# Altium project PCB_Project.PrjPcb
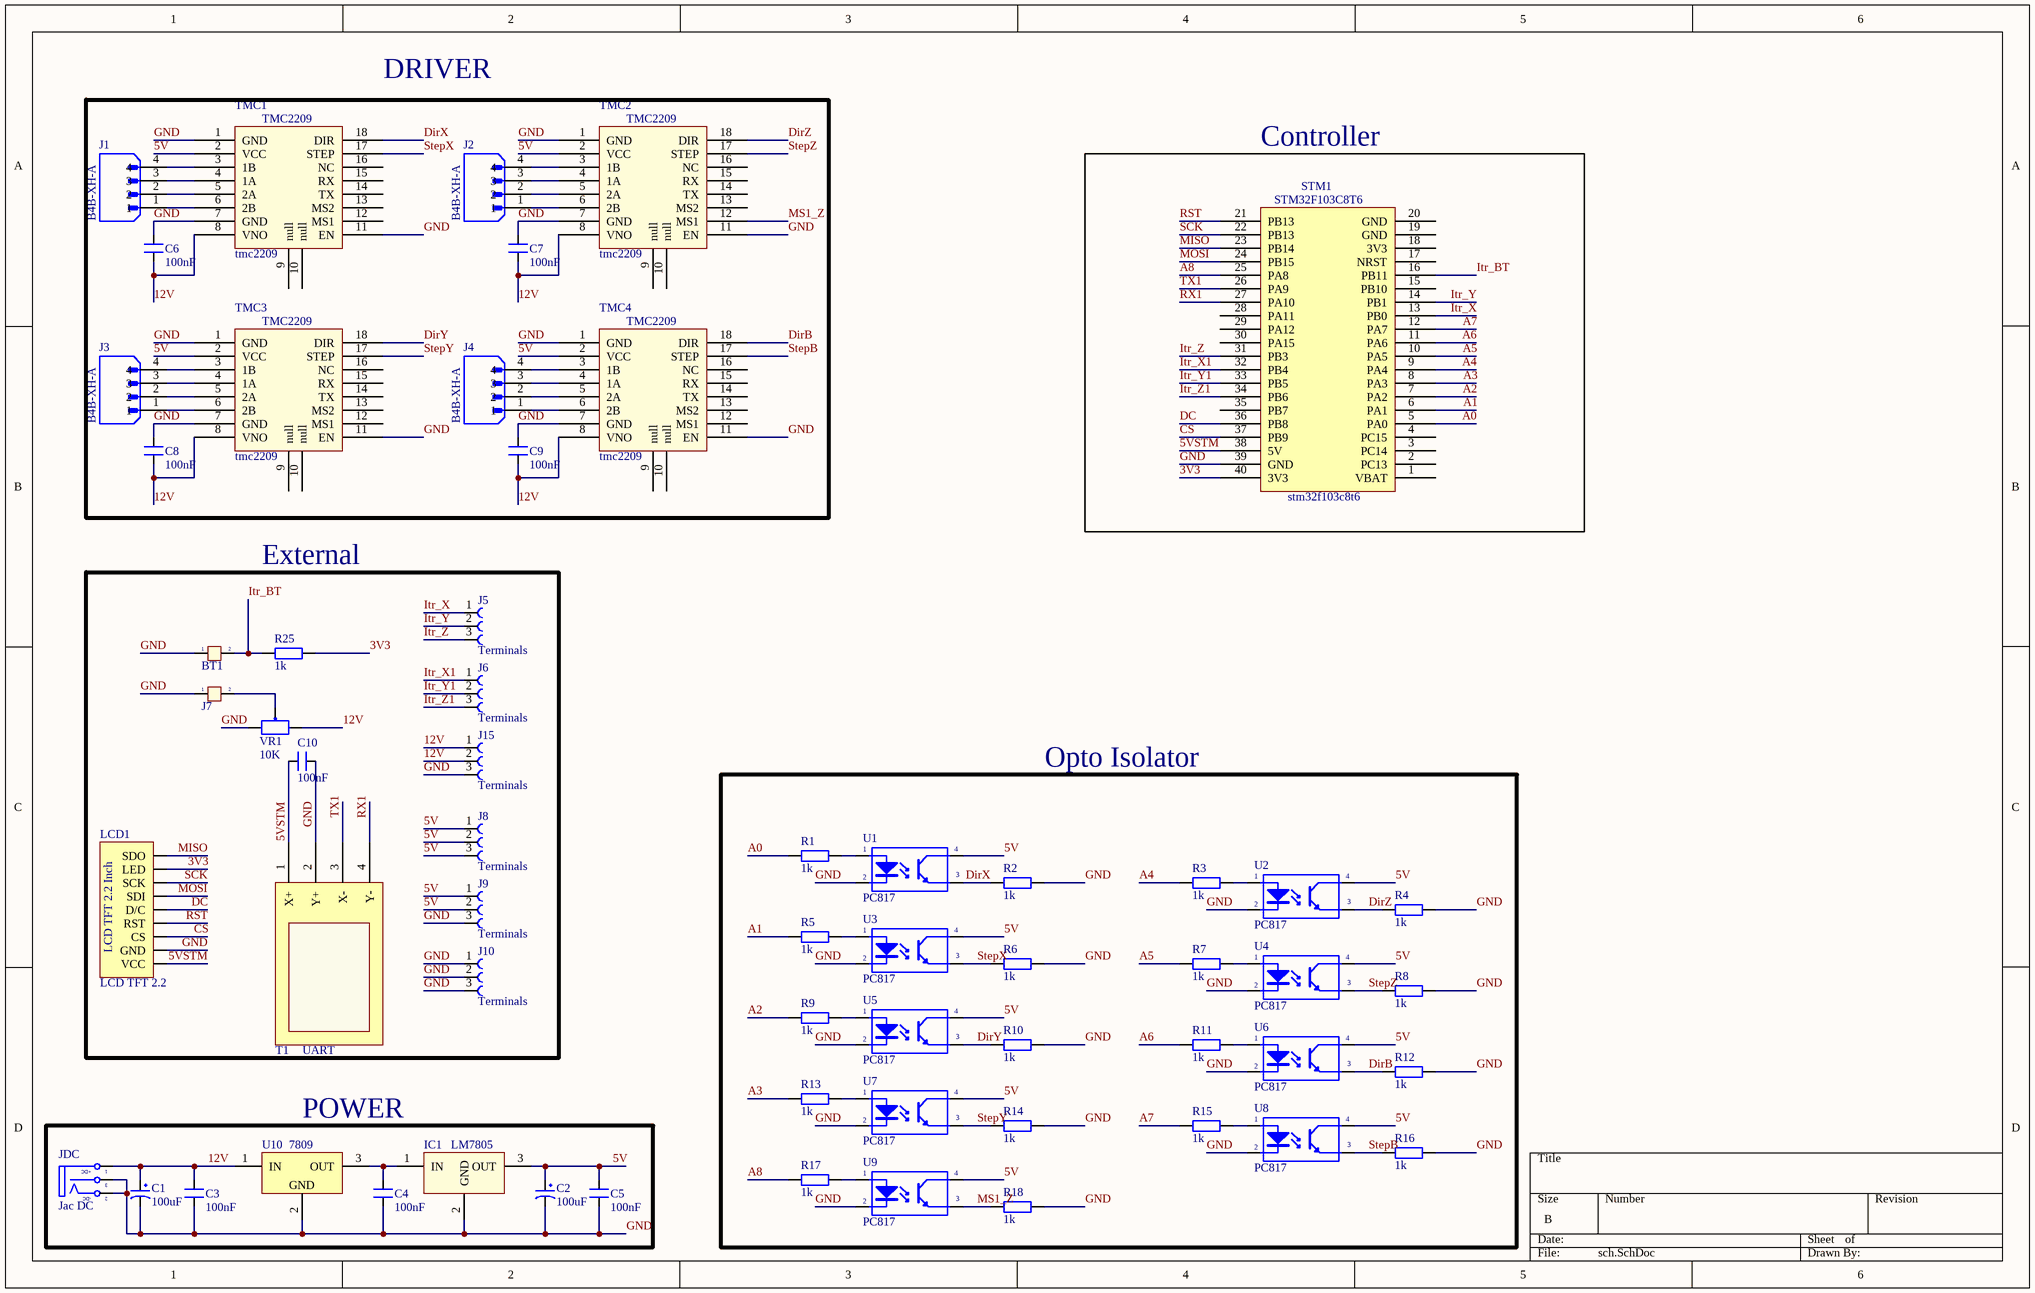
[diagram p0: sch.SchDoc]
1 sheet, 61 parts. Net scope: global (net labels, ports and power ports of the same name join across sheets).
Board files: PCB.PcbDoc, PCB_version2.PcbDoc

## Sheet sch.SchDoc
size B; SheetNumber: 1; SheetTotal: 2

### Parts
BT1  Jumper 2  [jp2h]  (value not drawn)
C1  100uF  [CP1.5/3.4]
C2  100uF  [CP1.5/3.4]
C3  100nF  [CN2]
C4  100nF  [CN2]
C5  100nF  [CN2]
C6  100nF  [CN2]
C7  100nF  [CN2]
C8  100nF  [CN2]
C9  100nF  [CN2]
C10  100nF  [CN2]
IC1  LM7805  [QTO-220]
J1  B4B-XH-A  [JST_B4B-XH-A(LF)(SN)]
J2  B4B-XH-A  [JST_B4B-XH-A(LF)(SN)]
J3  B4B-XH-A  [JST_B4B-XH-A(LF)(SN)]
J4  B4B-XH-A  [JST_B4B-XH-A(LF)(SN)]
J5  Terminals  [691214110003]
J6  Terminals  [691214110003]
J7  Jumper 2  [jp2h]  (value not drawn)
J8  Terminals  [691214110003]
J9  Terminals  [691214110003]
J10  Terminals  [691214110003]
J15  Terminals  [691214110003]
JDC  Jac DC  [DC-IN]
LCD1  LCD TFT 2.2  [JP9-C1T]
R1  1k  [R1/4W]
R2  1k  [R1/4W]
R3  1k  [R1/4W]
R4  1k  [R1/4W]
R5  1k  [R1/4W]
R6  1k  [R1/4W]
R7  1k  [R1/4W]
R8  1k  [R1/4W]
R9  1k  [R1/4W]
R10  1k  [R1/4W]
R11  1k  [R1/4W]
R12  1k  [R1/4W]
R13  1k  [R1/4W]
R14  1k  [R1/4W]
R15  1k  [R1/4W]
R16  1k  [R1/4W]
R17  1k  [R1/4W]
R18  1k  [R1/4W]
R25  1k  [R1/4W]
STM1  stm32f103c8t6  [STM32F103]
T1  UART  [HDR1X4H]
TMC1  tmc2209  [TMC2209]
TMC2  tmc2209  [TMC2209]
TMC3  tmc2209  [TMC2209]
TMC4  tmc2209  [TMC2209]
U1  PC817  [DIP4/W0.3]
U2  PC817  [DIP4/W0.3]
U3  PC817  [DIP4/W0.3]
U4  PC817  [DIP4/W0.3]
U5  PC817  [DIP4/W0.3]
U6  PC817  [DIP4/W0.3]
U7  PC817  [DIP4/W0.3]
U8  PC817  [DIP4/W0.3]
U9  PC817  [DIP4/W0.3]
U10  7809  [HDR1x3 BIG]
VR1  10K  [VR]

### Blocks framed on the sheet
DRIVER: C6-C9 J1-J4 TMC1-TMC4
Controller: STM1
External: BT1 C10 J5-J10 J15 LCD1 R25 T1 VR1
Opto Isolator: R1-R18 U1-U9
POWER: C1-C5 IC1 JDC U10

### Nets
3V3: LCD1.8(LED) R25.2 STM1.40(3V3)
5V: C2.1 C5.2 IC1.3(OUT) J8.1 J8.2 J8.3 J9.1 J9.2 TMC1.2(VCC) TMC2.2(VCC) TMC3.2(VCC) TMC4.2(VCC) U1.4(C) U2.4(C) U3.4(C) U4.4(C) U5.4(C) U6.4(C) U7.4(C) U8.4(C) U9.4(C)
5VSTM: C10.2 LCD1.1(VCC) STM1.38(5V) T1.1(X+)
12V: C1.1 C3.2 C6.1 C7.1 C8.1 C9.1 J15.1 J15.2 JDC.1(T) TMC1.8(VNO) TMC2.8(VNO) TMC3.8(VNO) TMC4.8(VNO) U10.1(IN) VR1.3
A0: R1.1 STM1.5(PA0)
A1: R5.1 STM1.6(PA1)
A2: R9.1 STM1.7(PA2)
A3: R13.1 STM1.8(PA3)
A4: R3.1 STM1.9(PA4)
A5: R7.1 STM1.10(PA5)
A6: R11.1 STM1.11(PA6)
A7: R15.1 STM1.12(PA7)
A8: R17.1 STM1.25(PA8)
CS: LCD1.3(CS) STM1.37(PB9)
DC: LCD1.5(D/C) STM1.36(PB8)
DirB: R12.1 TMC4.18(DIR) U6.3(E)
DirX: R2.1 TMC1.18(DIR) U1.3(E)
DirY: R10.1 TMC3.18(DIR) U5.3(E)
DirZ: R4.1 TMC2.18(DIR) U2.3(E)
GND: BT1.1 C1.2 C2.2 C3.1 C4.1 C5.1 C6.2 C7.2 C8.2 C9.2 C10.1 IC1.2(GND) J7.1 J9.3 J10.1 J10.2 J10.3 J15.3 JDC.2(TN) JDC.3(S) LCD1.2(GND) R2.2 R4.2 R6.2 R8.2 R10.2 R12.2 R14.2 R16.2 R18.2 STM1.39(GND) T1.2(Y+) TMC1.1(GND) TMC1.7(GND) TMC1.11(EN) TMC2.1(GND) TMC2.7(GND) TMC2.11(EN) TMC3.1(GND) TMC3.7(GND) TMC3.11(EN) TMC4.1(GND) TMC4.7(GND) TMC4.11(EN) U1.2(K) U2.2(K) U3.2(K) U4.2(K) U5.2(K) U6.2(K) U7.2(K) U8.2(K) U9.2(K) U10.2(GND) VR1.1
Itr_BT: BT1.2 R25.1 STM1.16(PB11)
Itr_X: J5.1 STM1.13(PB0)
Itr_X1: J6.1 STM1.32(PB4)
Itr_Y: J5.2 STM1.14(PB1)
Itr_Y1: J6.2 STM1.33(PB5)
Itr_Z: J5.3 STM1.31(PB3)
Itr_Z1: J6.3 STM1.34(PB6)
MISO: LCD1.9(SDO) STM1.23(PB14)
MOSI: LCD1.6(SDI) STM1.24(PB15)
MS1_Z: R18.1 TMC2.12(MS1) U9.3(E)
RST: LCD1.4(RST) STM1.21(PB13)
RX1: STM1.27(PA10) T1.4(Y-)
SCK: LCD1.7(SCK) STM1.22(PB13)
StepB: R16.1 TMC4.17(STEP) U8.3(E)
StepX: R6.1 TMC1.17(STEP) U3.3(E)
StepY: R14.1 TMC3.17(STEP) U7.3(E)
StepZ: R8.1 TMC2.17(STEP) U4.3(E)
TX1: STM1.26(PA9) T1.3(X-)
NetC4_2: C4.2 IC1.1(IN) U10.3(OUT)
NetJ1_1: J1.1 TMC1.6(2B)
NetJ1_2: J1.2 TMC1.5(2A)
NetJ1_3: J1.3 TMC1.4(1A)
NetJ1_4: J1.4 TMC1.3(1B)
NetJ2_1: J2.1 TMC2.6(2B)
NetJ2_2: J2.2 TMC2.5(2A)
NetJ2_3: J2.3 TMC2.4(1A)
NetJ2_4: J2.4 TMC2.3(1B)
NetJ3_1: J3.1 TMC3.6(2B)
NetJ3_2: J3.2 TMC3.5(2A)
NetJ3_3: J3.3 TMC3.4(1A)
NetJ3_4: J3.4 TMC3.3(1B)
NetJ4_1: J4.1 TMC4.6(2B)
NetJ4_2: J4.2 TMC4.5(2A)
NetJ4_3: J4.3 TMC4.4(1A)
NetJ4_4: J4.4 TMC4.3(1B)
NetJ7_2: J7.2 VR1.2
NetR1_2: R1.2 U1.1(A)
NetR3_2: R3.2 U2.1(A)
NetR5_2: R5.2 U3.1(A)
NetR7_2: R7.2 U4.1(A)
NetR9_2: R9.2 U5.1(A)
NetR11_2: R11.2 U6.1(A)
NetR13_2: R13.2 U7.1(A)
NetR15_2: R15.2 U8.1(A)
NetR17_2: R17.2 U9.1(A)

Not connected (* = marked no-connect by the designer): STM1 1(VBAT) 2(PC13) 3(PC14) 4(PC15) 15(PB10) 17(NRST) 18(3V3) 19(GND) 20(GND) 28(PA11) 29(PA12) 30(PA15) 35(PB7); TMC1 9(null) 10(null) 12(MS1) 13(MS2) 14(TX) 15(RX) 16(NC); TMC2 9(null) 10(null) 13(MS2) 14(TX) 15(RX) 16(NC); TMC3 9(null) 10(null) 12(MS1) 13(MS2) 14(TX) 15(RX) 16(NC); TMC4 9(null) 10(null) 12(MS1) 13(MS2) 14(TX) 15(RX) 16(NC)

### Notes on the sheet
- (in symbol DCIN) +DC; -DC
- (in symbol Driver_TMC2209) TMC2209
- (in symbol LCD TFT 2.2) LCD TFT 2.2 Inch
- (in symbol STM32F103) STM32F103C8T6

### Library data of the parts
BT1 J7 = JP 2: Value: JP 2
C1 C2 = CP3: Cap 100uF/35V - 470uF/16V; Value: 100uF/35V/50V; Description 1: 1000uF/6,3V - 470uF/16V - 330uF - 25V; Description 2: 220uF/35V - 100uF/50V - 63V - 4,7uF/200V; Description 3: 22uF => 33uF100V - 3,3uF => 4,7uF/250V; Description 4: 2,2uF =>3,3uF/350 - 2,2uF/400V - 1uF/450V
C3-C10 = CN2: Cap np 104 => 105pF; Value: 0.1uF
IC1 = LM78xx: On ap +, from + 5 to + 24VDC; Value: LM7805
J1-J4 = B4B-XH-A(LF)(SN): Price: None; MP: B4B-XH-A(LF)(SN); Value: *; Availability: Unavailable; Package: None
J5 J6 J8-J10 J15 = 691214110003: 3 Position Wire to Board Terminal Block Horizontal with Board 0.138 (3.50mm) Through Hole; MF: Wurth Elektronik; MP: 691214110003; Value: *; SnapEDA_Link: https://www.snapeda.com/parts/691214110003/Wurth+Elektronik/view-part/?ref=snap; Package: None; Availability: In Stock; Purchase-URL: https://pricing.snapeda.com/search/part/691214110003/?ref=eda; Check_prices: https://www.snapeda.com/parts/691214110003/Wurth+Elektronik/view-part/?ref=eda; Price: None
JDC = DCIN: Jac DC input; Value: Jac DC
LCD1 = LCD TFT 2.2: Manufacturer: W¨¹rth Elektronik eiSos GmbH; partNo: 613009143121; ComponentLink1 Description: Manufacturer; ComponentLink2 Description: Datasheet; NoPins: 09; Created Date: 29 March 2013; ComponentLink1URL: http://www.we-online.com; ComponentLink2URL: http://katalog.we-online.de/em/datasheet/6130xx143121.pdf; Created by: Karrer Zheng
R1-R18 R25 = R1/4W: Resistor 1/4W; Value: R1/4W - 1K
STM1 = STM32F103
T1 = TouchPanel: 4 wires; Creator: Nguyen Ba Bien; Date Created: 14-04-2010
TMC1-TMC4 = Driver_TMC2209
U1-U9 = PC817: Single Opto; Value: PC817
U10 = 7809: Positive Voltage Regulator; Note: Tab is connected to pin 3 (GND).; Published: 24-Aug-2001; LatestRevisionDate: 17-Jul-2002; LatestRevisionNote: Re-released for DXP Platform.; DatasheetVersion: Apr-1994; PackageReference: SOT82C; Publisher: Altium Limited; PackageDescription: SIP; 3 Leads; Body 10.9 x 7.6 x 2.6 mm (typ); Pitch 2.2 mm; ComponentLink1Description: Manufacturer Link; ComponentLink1URL: http://www.st.com/; ComponentLink2Description: Datasheet; ComponentLink2URL: http://www.st.com/stonline/products/literature/ds/2146/l78m05c.pdf
VR1 = VR: Var Resistor; Value: VR 10K